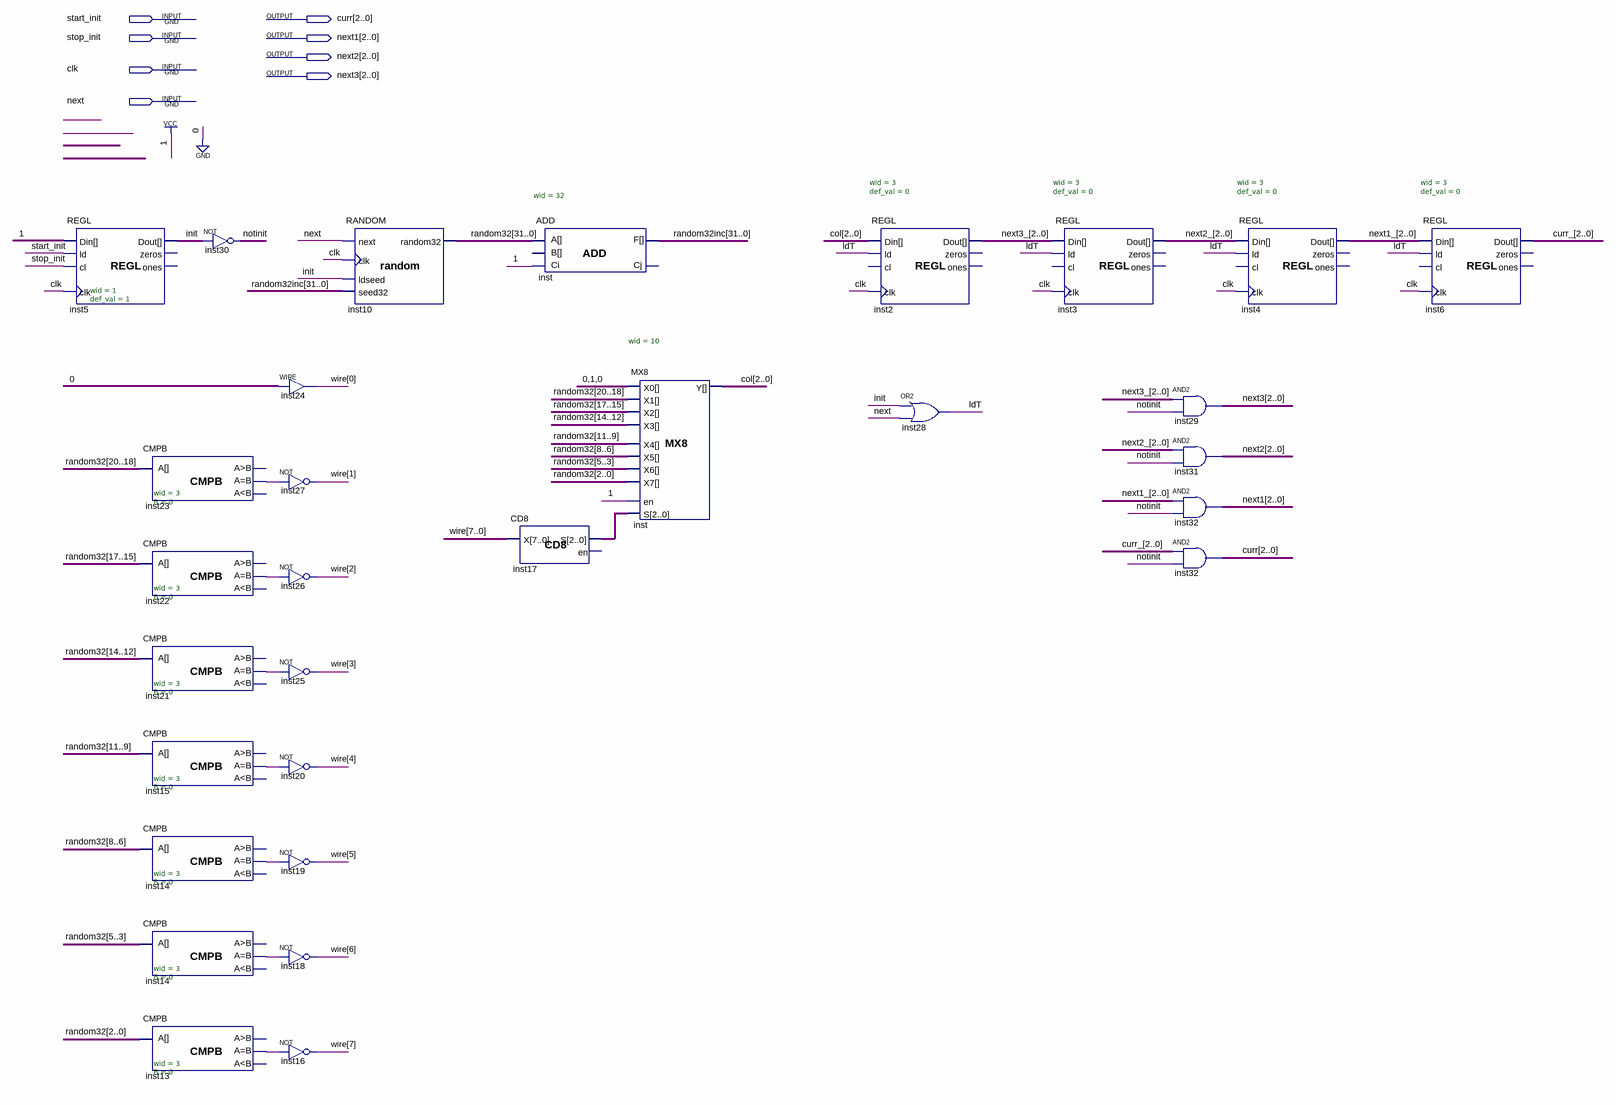
[diagram p0: schematic sheet]
// Quartus schematic gentetrimini.bdf as structural Verilog: 30 symbols, 8 pins
module gentetrimini (
  input  start_init,
  input  stop_init,
  input  clk,
  input  next,
  output [2:0] curr,
  output [2:0] next1,
  output [2:0] next2,
  output [2:0] next3
);

  wire init, inst13_eq, inst14_eq, inst14_eq_2, inst15_eq, inst21_eq, inst22_eq, inst23_eq, ldT, notinit;
  wire [2:0] col, curr_, inst17_s, next1_, next2_, next3_;
  wire [7:0] \wire ;
  wire [31:0] random32, random32inc;

  REGL #(.wid(1), .def_val(1)) inst5 (
    .Din(1'b1), .ld(start_init), .cl(stop_init), .clk(clk), .Dout(init));  // open: zeros, ones
  CMPB #(.wid(3), .B(0)) inst23 (.A(random32[20:18]), .eq(inst23_eq));  // open: gr, ls
  CMPB #(.wid(3), .B(0)) inst22 (.A(random32[17:15]), .eq(inst22_eq));  // open: gr, ls
  CMPB #(.wid(3), .B(0)) inst21 (.A(random32[14:12]), .eq(inst21_eq));  // open: gr, ls
  CMPB #(.wid(3), .B(0)) inst15 (.A(random32[11:9]), .eq(inst15_eq));  // open: gr, ls
  CMPB #(.wid(3), .B(0)) inst14 (.A(random32[8:6]), .eq(inst14_eq_2));  // open: gr, ls
  CMPB #(.wid(3), .B(0)) inst14_dup2 (.A(random32[5:3]), .eq(inst14_eq));  // open: gr, ls
  CMPB #(.wid(3), .B(0)) inst13 (.A(random32[2:0]), .eq(inst13_eq));  // open: gr, ls
  not inst30 (notinit, init);
  assign \wire [0] = 1'b0;  // WIRE inst24
  not inst27 (\wire [1], inst23_eq);
  not inst26 (\wire [2], inst22_eq);
  not inst25 (\wire [3], inst21_eq);
  not inst20 (\wire [4], inst15_eq);
  not inst19 (\wire [5], inst14_eq_2);
  not inst18 (\wire [6], inst14_eq);
  not inst16 (\wire [7], inst13_eq);
  RANDOM inst10 (.next(next), .clk(clk), .ldseed(init), .seed(random32inc), .random(random32));
  ADD #(.wid(32)) inst (.A(random32), .Ci(1'b1), .F(random32inc));  // open: B, Cj
  CD8 inst17 (.X(\wire ), .S(inst17_s));  // open: en
  MX8 #(.wid(10)) inst_dup2 (
    .X0(3'b010), .X1(random32[20:18]), .X2(random32[17:15]), .X3(random32[14:12]), .X4(random32[11:9]),
    .X5(random32[8:6]), .X6(random32[5:3]), .X7(random32[2:0]), .en(1'b1), .S(inst17_s), .Y(col));
  REGL #(.wid(3), .def_val(0)) inst2 (.Din(col), .ld(ldT), .clk(clk), .Dout(next3_));  // open: cl, zeros, ones
  or inst28 (ldT, init, next);
  REGL #(.wid(3), .def_val(0)) inst3 (.Din(next3_), .ld(ldT), .clk(clk), .Dout(next2_));  // open: cl, zeros, ones
  assign next3 = next3_ & {3{notinit}};  // AND2 inst29, 3 bits wide
  assign next2 = next2_ & {3{notinit}};  // AND2 inst31, 3 bits wide
  assign next1 = next1_ & {3{notinit}};  // AND2 inst32, 3 bits wide
  assign curr = curr_ & {3{notinit}};  // AND2 inst32, 3 bits wide
  REGL #(.wid(3), .def_val(0)) inst4 (.Din(next2_), .ld(ldT), .clk(clk), .Dout(next1_));  // open: cl, zeros, ones
  REGL #(.wid(3), .def_val(0)) inst6 (.Din(next1_), .ld(ldT), .clk(clk), .Dout(curr_));  // open: cl, zeros, ones
endmodule
